# EAGLE schematic SPI_SensorShield (EAGLE 7.6.0)
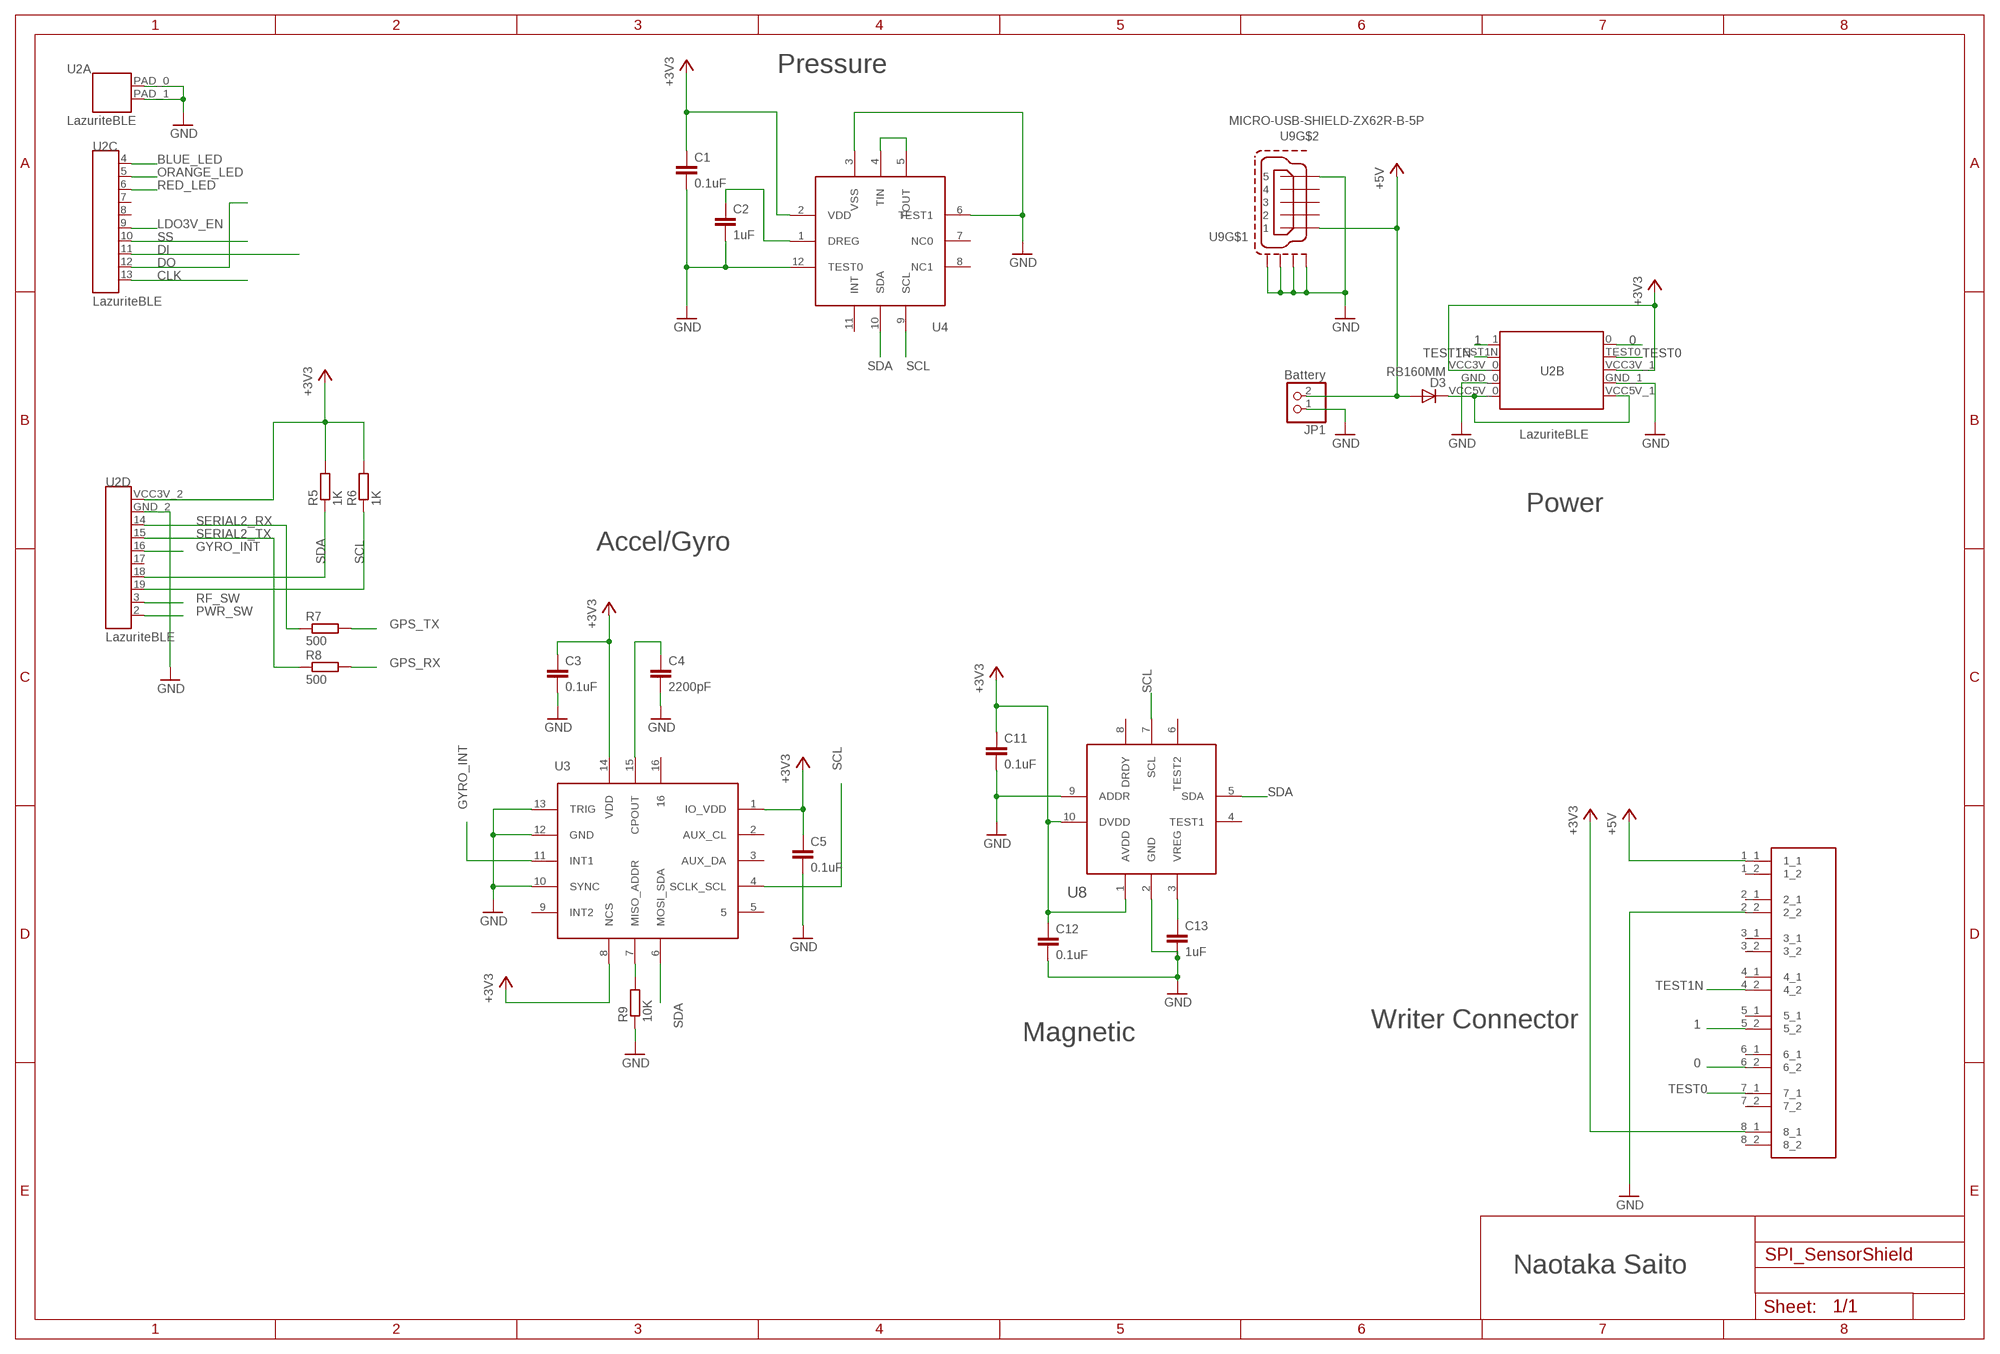
[diagram p0: schematic, sheet 1]

## Parts
C1  0.1uF  C-EUC0603  [C0603]
C2  1uF  C-EUC0603  [C0603]
C3  0.1uF  C-EUC0603  [C0603]
C4  2200pF  C-EUC0603  [C0603]
C5  0.1uF  C-EUC0603  [C0603]
C11  0.1uF  C-EUC0603  [C0603]
C12  0.1uF  C-EUC0603  [C0603]
C13  1uF  C-EUC0603  [C0603]
D3  RB160MM  [RB160MM-30]
JP1  Battery  PINHD-1X2  [1X02]
R5  1K  R-EU_R0603  [R0603]
R6  1K  R-EU_R0603  [R0603]
R7  500  R-EU_R0603  [R0603]
R8  500  R-EU_R0603  [R0603]
R9  10K  R-EU_R0603  [R0603]
U2  LazuriteBLE  LAZURITE920JLAZURITE920J  [LAZURITE920J]
U3  KXG03  [KXG03]
U4  BM1383AGLV  [BM1383AGLV]
U8  BM1422AGMV  [BM1422AGMV]
U9  MICRO-USB-SHIELD-ZX62R-B-5P  [ZX62R-B-5P]
U$1  XB-1-X  [XB-1-X]

## Nets
0: U2.0 U$1.6_2
1: U2.1 U$1.5_2
+3V3: C1.1 C3.1 C5.1 C11.1 C12.1 R5.2 R6.2 U2.VCC3V_0(B:VCC3V_0) U2.VCC3V_1(B:VCC3V_1) U2.VCC3V_2(D:VCC3V_2) U3.1(IO_VDD) U3.8(NCS) U3.14(VDD) U4.2(VDD) U8.1(AVDD) U8.10(DVDD) U$1.8_1
+5V: D3.A JP1.2 U9.1 U$1.1_1
BLUE_LED: U2.4
CLK: U2.13
DI: U2.11
DO: U2.12
GND: C1.2 C2.2 C3.2 C4.2 C5.2 C11.2 C12.2 C13.2 JP1.1 R9.1 U2.GND_0(B:GND_0) U2.GND_1(B:GND_1) U2.GND_2(D:GND_2) U2.PAD_0(A:PAD_0) U2.PAD_1(A:PAD_1) U3.10(SYNC) U3.12(GND) U3.13(TRIG) U4.3(VSS) U4.6(TEST1) U4.12(TEST0) U8.2(GND) U8.9(ADDR) U9.5 U9.M1(S1) U9.M2(S2) U9.M3(S3) U9.M4(S4) U$1.2_2
GPS_RX: R8.2
GPS_TX: R7.2
GYRO_INT: U2.16 U3.11(INT1)
LDO3V_EN: U2.9
N$3: U4.4(TIN) U4.5(TOUT)
N$5: R9.2 U3.7(MISO_ADDR)
N$7: C2.1 U4.1(DREG)
N$10: D3.C U2.VCC5V_0(B:VCC5V_0) U2.VCC5V_1(B:VCC5V_1)
N$15: C13.1 U8.3(VREG)
N$16: C4.1 U3.15(CPOUT)
ORANGE_LED: U2.5
PWR_SW: U2.2
RED_LED: U2.6
RF_SW: U2.3
SCL: R6.1 U2.19 U3.4(SCLK_SCL) U4.9(SCL) U8.7(SCL)
SDA: R5.1 U2.18 U3.6(MOSI_SDA) U4.10(SDA) U8.5(SDA)
SERIAL2_RX: R7.1 U2.14
SERIAL2_TX: R8.1 U2.15
SS: U2.10
TEST0: U2.TEST0(B:TEST0) U$1.7_1
TEST1N: U2.TEST1N(B:TEST1N) U$1.4_2
Unconnected: U2.7 U2.8 U2.17 U3.2(AUX_CL) U3.3(AUX_DA) U3.5 U3.9(INT2) U3.16 U4.7(NC0) U4.8(NC1) U4.11(INT) U8.4(TEST1) U8.6(TEST2) U8.8(DRDY) U9.2 U9.3 U9.4 U$1.1_2 U$1.2_1 U$1.3_1 U$1.3_2 U$1.4_1 U$1.5_1 U$1.6_1 U$1.7_2 U$1.8_2

## Notes on the sheet
- Pressure
- Power
- Accel/Gyro
- Writer Connector
- Magnetic
- Naotaka Saito

## Library data of the parts
C1-C5 C11-C13 = rcl:C-EU: CAPACITOR, European symbol
D3 = lazurite:RB160MM
JP1 = pinhead:PINHD-1X2: PIN HEADER
R5-R9 = rcl:R-EU_: RESISTOR, European symbol
U2 = lazurite:LAZURITE920J: Lazurite 920J HIROSUGI PSS-710103-10 1.27pitch 1x10pin pin header x 2pcs HIROSUGI PSS-720102-05 1.27pitch 2x5pin pin header
U3 = lz-shield:KXG03: Digi-Key品番 1191-1043-1-ND
U4 = lz-shield:BM1383AGLV: Digi-Key品番 BM1383AGLV-ZE2CT-ND
U8 = lz-shield:BM1422AGMV
U9 = con-hirose:MICRO-USB-SHIELD-: Hirose Micro USB Connector ZX62R-B-5P: Micro B, reverse (top mount) shell SMT Supplier: DigiKey H11574CT-ND Source: http://www.hirose.co.jp/cataloge_hp/e24200011.pdf
U$1 = lz-shield:XB-1-X